# Altium schematic sheet POWER.SchDoc (part 3 of 3)
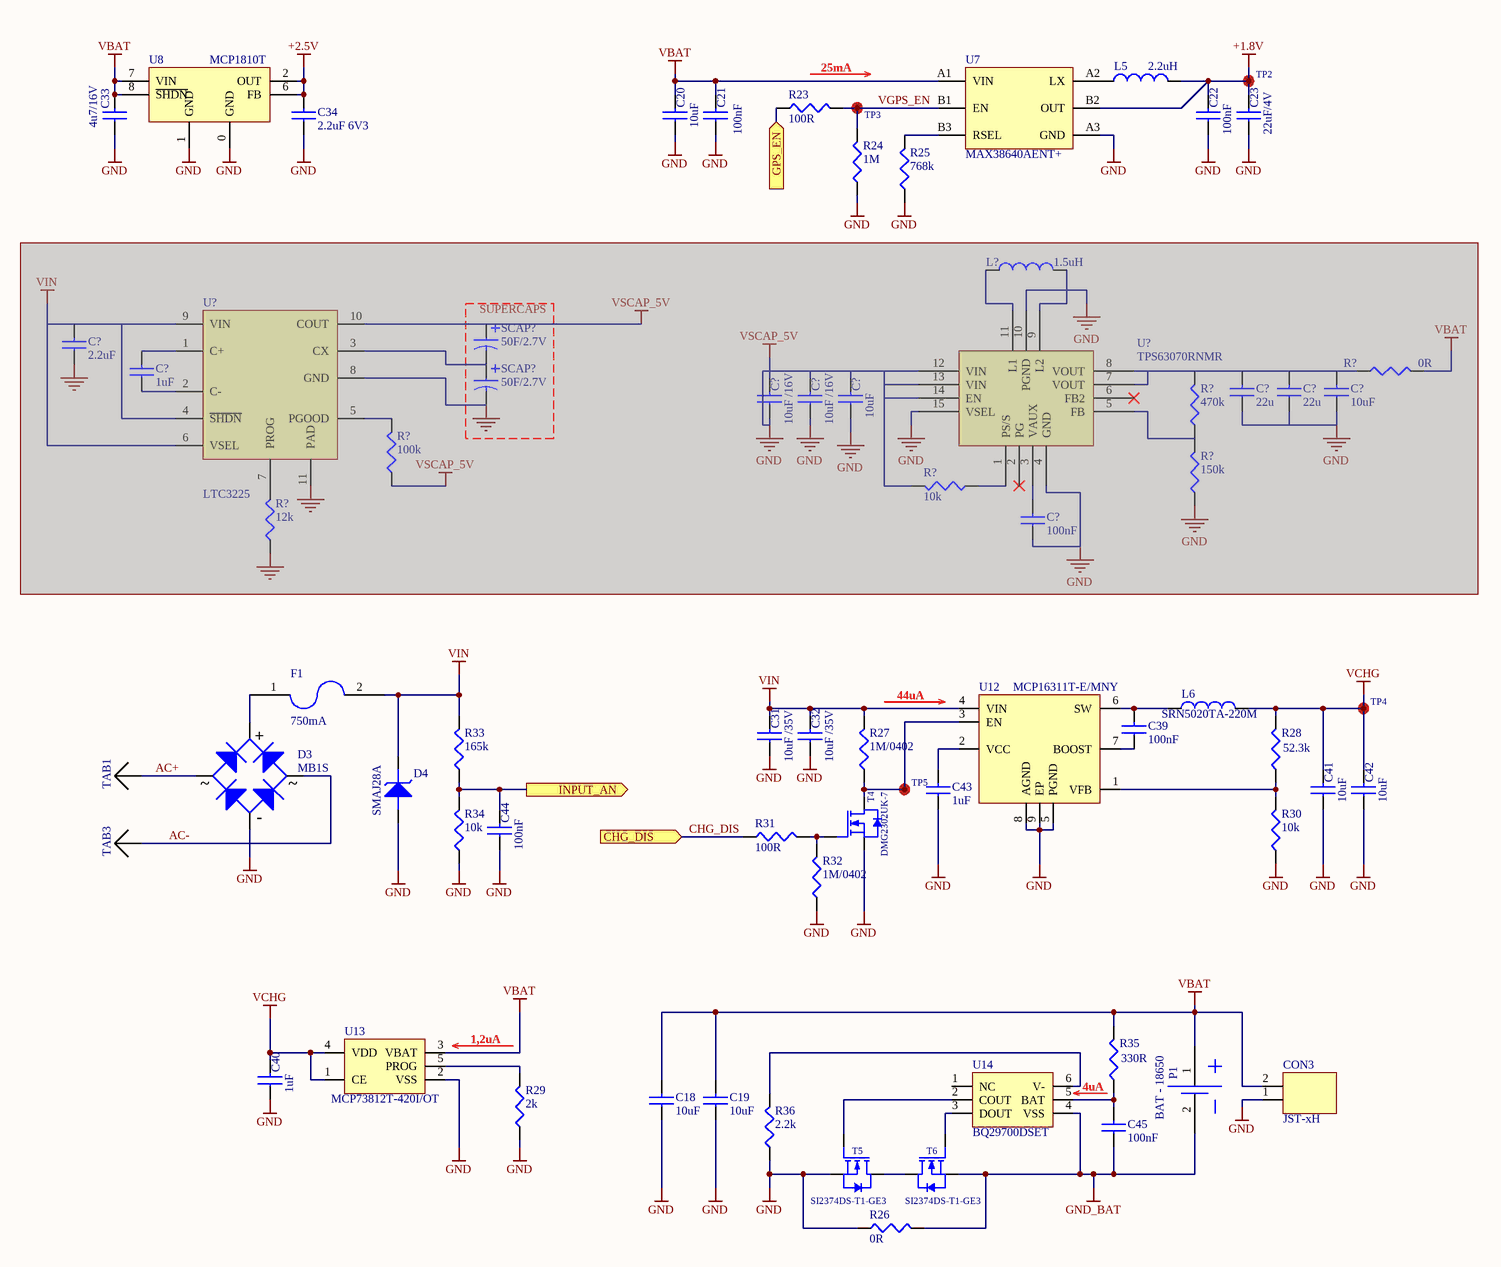
[diagram p2: POWER.SchDoc]

## Library data of the parts (continued)
T5 T6 = T_M - SI2374DS-T1-GE3: MOSFET Transistor, N Channel, 5.9 A, 20 V, 0.025 ohm, 4.5 V, 1 V; ELRAD Id sifra / ELRAD Id No: 597778; Opis / Description: MOSFET BSS123       /N-Channel; Komp / Device: SMD; Value: BSS123; Velikost / Size: SOT23; FIT: 0.44; Manufacturer Part Number: SI2374DS-T1-GE3; Author: Ciril Golob; ComponentLink1Description: Datasheet; ComponentLink1URL: http://www.farnell.com/datasheets/2148574.pdf?_ga=2.241812546.1501170171.1569221802-1373726713.1554121096&_gac=1.51911131.1567774175.Cj0KCQjwh8jrBRDQARIsAH7BsXewc7Dwr4vpljjl78IYTw8YgbCKKX8PqbiwpEZSRALCWSJq0A6KVZoaAvm4EALw_wcB; Date: 11.07.2018; ComponentLINK1Description: Datasheet; ComponentLINK2Description: Datasheet www; ComponentLINK1URL: c:\ELRADSVN\Altium_Library\Libraries\Active\Datasheet\BSS123.pdf; ComponentLINK2URL: http://www.onsemi.com/pub/Collateral/BSS123-D.PDF; Supplier 1: Farnell; Supplier Part Number 1: 2646371
TAB1 TAB3 = TAB - WP-SMBU SMD: WP-SMBU SMD Internal blind-hole thread w. Pins; Manufacturer Part Number: 7466203; ComponentLink1Description: Datasheet; ComponentLink1URL: https://katalog.we-online.com/em/datasheet/7466103.pdf; Supplier 1: Farnell; Supplier Part Number 1: 2405986
TP2-TP5 = TestPoint: TEST POINT ROUND SMD; FIT: 0.94; Komp / Device: SMD; ComponentLink1Description: Datasheet
U7 = V_SW - MAX38640AENT+: Switching Voltage Regulators Tiny 300nA nanoPower Buck converters in uDFN and WLP pacakges; Manufacturer: ROHM; Manufacturer Part Number: BD70522GUL; Topology: Buck (Step Down); Input Voltage Min: 4.5; Input Voltage Max: 45; No. of Outputs: 1; DC / DC Converter IC Case: TO-263; No. of Pins: 5; Output Current: 3; Output Voltage Min: 1.23; Output Voltage Max: 37; Switching Frequency: 150; SVHC: No SVHC (12-Jan-2017; RoHS: YES; Operating Temperature Max: 125; Packaging: Each; Product Range: -; Automotive Qualification Standard: -; MSL: MSL 1 - Unlimited; ComponentLink1Description: Datasheet; ComponentLink1URL: https://eu.mouser.com/datasheet/2/256/MAX38640A-MAX38643B-1516623.pdf; Supplier 1: Mouser; Supplier Part Number 1: 700-MAX38640AENT+
U8 = V_LIN - MCP1810T: LDO Voltage Regulator, Fixed, 2.5 V to 5.5 V in, 2.5 V/150 mA out, 380 mV drop; Manufacturer: ON SEMICONDUCTOR; Manufacturer Part Number: LM2596DSADJG; Topology: Buck (Step Down); Input Voltage Min: 4.5; Input Voltage Max: 45; No. of Outputs: 1; DC / DC Converter IC Case: TO-263; No. of Pins: 5; Output Current: 3; Output Voltage Min: 1.23; Output Voltage Max: 37; Switching Frequency: 150; SVHC: No SVHC (12-Jan-2017; RoHS: YES; Stock 1: 342; Pricing 1: 1=1.98, 10=1.49, 100=1.19, 500=1.04, 1000=0.859, 2500=0.785 (GBP); Operating Temperature Max: 125; Packaging: Each; Product Range: -; Automotive Qualification Standard: -; MSL: MSL 1 - Unlimited; Supplier 1: Farnell; Supplier 2: Mouser; Supplier 3: Digi-Key; Supplier Part Number 1: 2678432; Supplier Part Number 2: 579-MCP1810T-25I/J8A; Supplier Part Number 3: MCP1810T-25I/J8ADKR-ND
U12 = V_SW - MCP16311T-E/MNY: DC-DC Synchronous Buck Regulator, Adjustable, 4.4V to 30V In, 2V to 24V/1A Out, 500kHz; Manufacturer: ROHM; Manufacturer Part Number: BD70522GUL; Topology: Buck (Step Down); Input Voltage Min: 4.5; Input Voltage Max: 45; No. of Outputs: 1; DC / DC Converter IC Case: TO-263; No. of Pins: 5; Output Current: 3; Output Voltage Min: 1.23; Output Voltage Max: 37; Switching Frequency: 150; SVHC: No SVHC (12-Jan-2017; RoHS: YES; Operating Temperature Max: 125; Packaging: Each; Product Range: -; Automotive Qualification Standard: -; MSL: MSL 1 - Unlimited; ComponentLink1Description: DataSheet; ComponentLink1URL: http://www.farnell.com/datasheets/1886710.pdf?_ga=2.254397512.1501170171.1569221802-1373726713.1554121096&_gac=1.218101220.1567774175.Cj0KCQjwh8jrBRDQARIsAH7BsXewc7Dwr4vpljjl78IYTw8YgbCKKX8PqbiwpEZSRALCWSJq0A6KVZoaAvm4EALw_wcB; Supplier 1: Farnell; Supplier Part Number 1: 2857600
U13 = V_CHG - MCP73812T-420I/OT: Battery Charger for 1 Cell of Li-Ion, Li-Pol battery, 6V input, 4.2V / 500mA charge; Manufacturer: ROHM; Manufacturer Part Number: BD70522GUL; Topology: Buck (Step Down); Input Voltage Min: 4.5; Input Voltage Max: 45; No. of Outputs: 1; DC / DC Converter IC Case: TO-263; No. of Pins: 5; Output Current: 3; Output Voltage Min: 1.23; Output Voltage Max: 37; Switching Frequency: 150; SVHC: No SVHC (12-Jan-2017; RoHS: YES; Operating Temperature Max: 125; Packaging: Each; Product Range: -; Automotive Qualification Standard: -; MSL: MSL 1 - Unlimited; ComponentLink1Description: DataSheet; ComponentLink1URL: http://www.farnell.com/datasheets/77596.pdf?_ga=2.208849234.1501170171.1569221802-1373726713.1554121096&_gac=1.183481812.1567774175.Cj0KCQjwh8jrBRDQARIsAH7BsXewc7Dwr4vpljjl78IYTw8YgbCKKX8PqbiwpEZSRALCWSJq0A6KVZoaAvm4EALw_wcB; Supplier 1: Farnell; Supplier Part Number 1: 1627187
U14 = BAT_PROTECT - BQ29700DSET: Li-Ion Battery, Li-Pol Voltage & Current Protector, Single Cell, 1.5 V to 8 V supply,; Manufacturer: ON SEMICONDUCTOR; Manufacturer Part Number: LM2596DSADJG; Topology: Buck (Step Down); Input Voltage Min: 4.5; Input Voltage Max: 45; No. of Outputs: 1; DC / DC Converter IC Case: TO-263; No. of Pins: 5; Output Current: 3; Output Voltage Min: 1.23; Output Voltage Max: 37; Switching Frequency: 150; SVHC: No SVHC (12-Jan-2017; RoHS: YES; Stock 1: 342; Pricing 1: 1=1.98, 10=1.49, 100=1.19, 500=1.04, 1000=0.859, 2500=0.785 (GBP); Operating Temperature Max: 125; Packaging: Each; Product Range: -; Automotive Qualification Standard: -; MSL: MSL 1 - Unlimited; ComponentLink1Description: Datasheet; ComponentLink1URL: http://www.ti.com/lit/ds/symlink/bq2970.pdf; Supplier 1: Farnell; Supplier Part Number 1: 3123826
U?#1 = LTC3225EDDB#TRMPBF: LINEAR TECHNOLOGY         LTC3225EDDB#TRMPBF            IC, SUPERCAP CHARGER, 150MA, 10DFN; Manufacturer: Analog Devices / Linear Technology; Number of Cells: 2; Max Input Voltage: 5.5V; Min Supply Voltage: 2.8V; Operating Supply Current: 20uA; Max Output Voltage: 5.3V; Max Charge Current: 175mA; Topology: Charge Pump; Supplier 1: Digi-Key; Manufacturer Part Number: LTC3225EDDB#TRMPBF; Stock 1: 500; Pricing 1: 500=2.397 (USD); Case/Package: DFN EP; Number of Pins: 10; Min Operating Temperature: -40°C; Max Operating Temperature: 85°C; Max Supply Voltage: 5.5V; Package Quantity: 1; Packaging: Tape and Reel; Termination: SMD/SMT; Length: 3mm; Radiation Hardening: No; REACH SVHC: No SVHC; Lead Free: Lead Free; ComponentLink1URL: https://datasheet.ciiva.com/1144/370169-1144965.pdf; ComponentLink1Description: https://datasheet.ciiva.com/1144/370169-1144965.pdf; ComponentLink2URL: https://datasheet.ciiva.com/26883/ltc3225eddb-trmpbf-26883289.pdf; ComponentLink2Description: https://datasheet.ciiva.com/26883/ltc3225eddb-trmpbf-26883289.pdf; ComponentLink3URL: https://datasheet.ciiva.com/22693/1705664-22693414.pdf; ComponentLink3Description: https://datasheet.ciiva.com/22693/1705664-22693414.pdf; ComponentLink4URL: https://datasheet.ciiva.com/1964/26420-1964792.pdf; ComponentLink4Description: https://datasheet.ciiva.com/1964/26420-1964792.pdf; ComponentLink5URL: https://datasheet.ciiva.com/1964/26420-1964793.pdf; ComponentLink5Description: https://datasheet.ciiva.com/1964/26420-1964793.pdf; ComponentLink6URL: https://datasheet.ciiva.com/1964/26420-1964794.pdf; ComponentLink6Description: https://datasheet.ciiva.com/1964/26420-1964794.pdf; ComponentLink7URL: https://datasheet.ciiva.com/15104/getdatasheetpartid-372123-15104298.pdf; ComponentLink7Description: https://datasheet.ciiva.com/15104/getdatasheetpartid-372123-15104298.pdf; ComponentLink8URL: https://datasheet.ciiva.com/1139/1441932-1139820.pdf; ComponentLink8Description: https://datasheet.ciiva.com/1139/1441932-1139820.pdf; ComponentLink9URL: https://datasheet.ciiva.com/1139/1441932-1139821.pdf; ComponentLink9Description: https://datasheet.ciiva.com/1139/1441932-1139821.pdf; Supplier Part Number 1: LTC3225EDDB#TRMPBFTR-ND
U?#2 = TPS63070RNMR: Buck-Boost Switching Regulator IC Positive Adjustable 2.5V 1 Output 2A 15-PowerVFQFN; Manufacturer: Texas Instruments; Number of Outputs: 1; Min Input Voltage: 2V; Max Input Voltage: 16V; Max Output Voltage: 9V; Switching Frequency: 2.4MHz; Synchronous Rectifier: Yes; Quiescent Current: 50uA; Supplier 1: Digi-Key; Manufacturer Part Number: TPS63070RNMR; Stock 1: 27521; Pricing 1: 1=2.67, 10=2.402, 100=1.9306, 500=1.5862, 1000=1.31428 (USD); Mount: Surface Mount; Case/Package: VQFN; Number of Pins: 15; Min Operating Temperature: -40°C; Max Operating Temperature: 125°C; Packaging: Tape and Reel; Min Output Voltage: 2.5V; Output Current: 2A; Topology: Buck-Boost; Output Type: Adjustable; Output Configuration: Positive; Lead Free: Lead Free; Supplier Part Number 1: 296-44874-1-ND; ComponentLink1Description: Datasheet; ComponentLink1URL: http://www.ti.com/lit/ds/symlink/tps63070.pdf